# Altium schematic sheet USART_LPUART.SchDoc: USART_LPUART
size A3; Project: STM32L073Z-EVAL; Date: Not used; ApprovedBy: Not used; CheckedBy: Not used; Author: Not used; CompanyName: STMicroelectronics; DrawnBy: Not used; Engineer: Not used; Organization: Not used; Address1: Not used; Address2: Not used; Address3: Not used; Address4: Not used; DocumentNumber: 7; Revision: Not used; SheetNumber: 8; SheetTotal: 13; CurrentTime: Not used; CurrentDate: Not used; Time: Not used; DocumentFullPathAndName: Not used; DocumentName: Not used; ModifiedDate: Not used; ImagePath: Not used; ProjectName: Not used; Application_BuildNumber: Not used
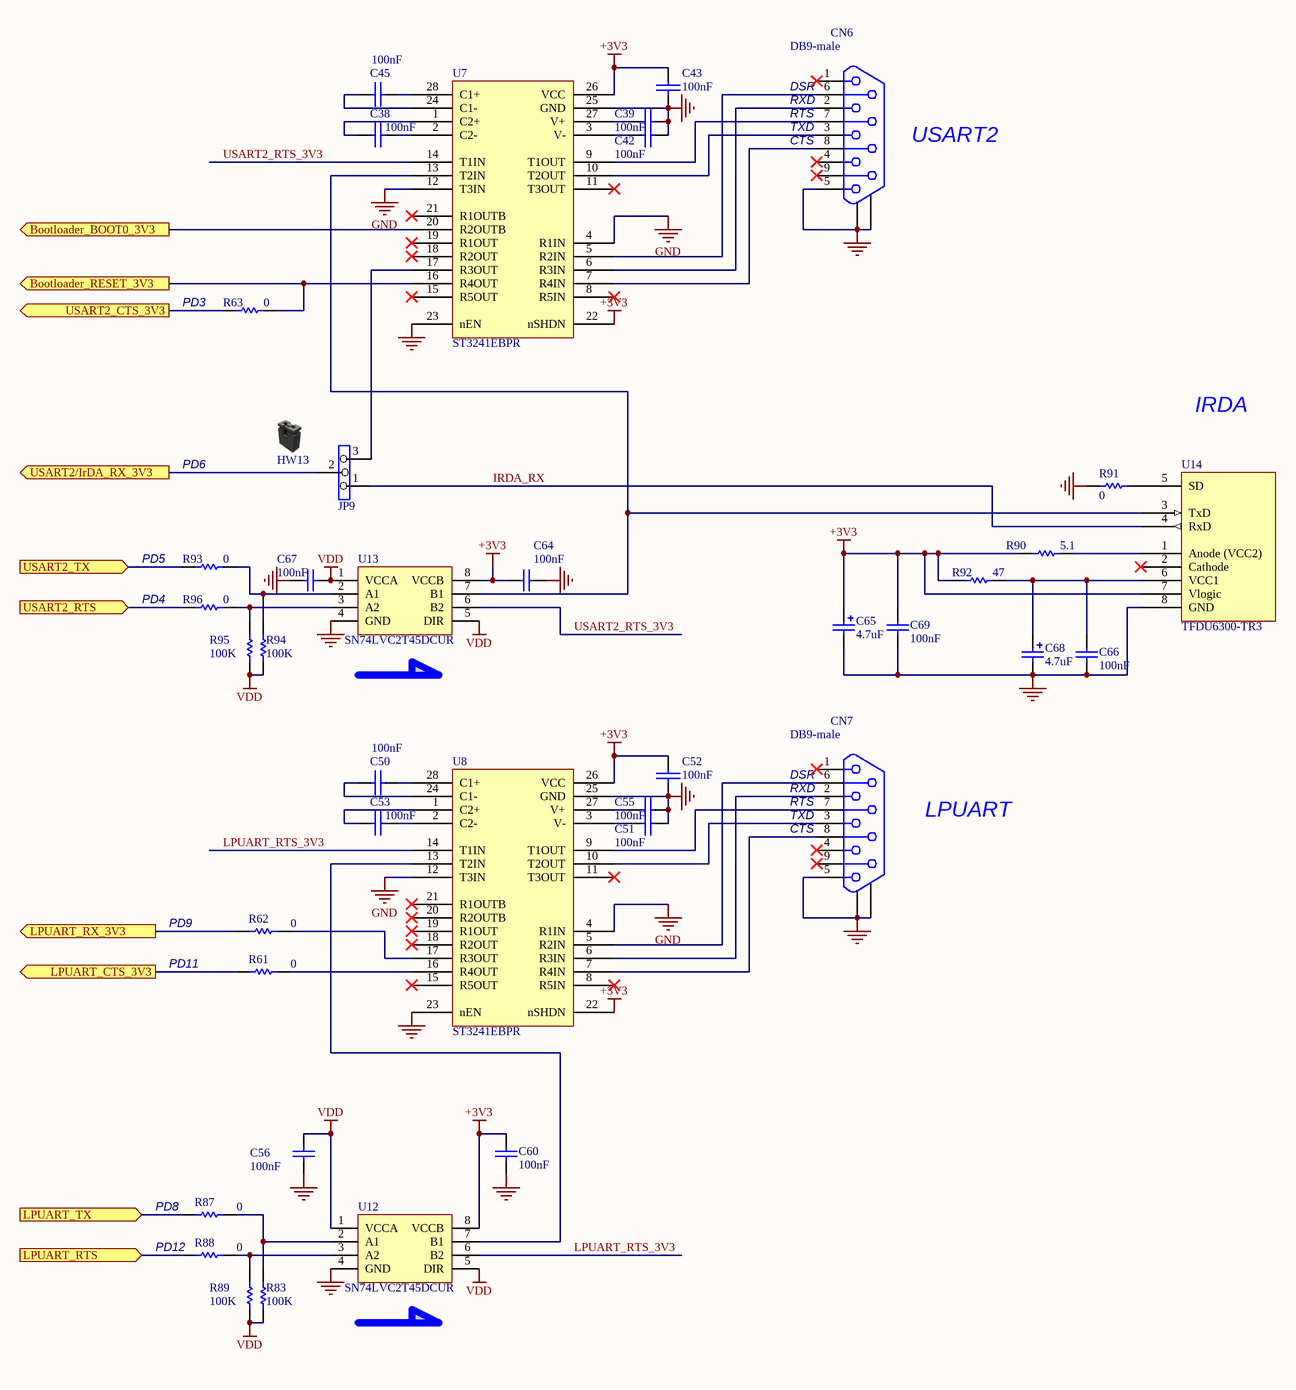
[diagram p0: USART_LPUART.SchDoc]

## Parts
C38  100nF  [0402C]
C39  100nF  [0402C]
C42  100nF  [0402C]
C43  100nF  [0402C]
C45  100nF  [0402C]
C50  100nF  [0402C]
C51  100nF  [0402C]
C52  100nF  [0402C]
C53  100nF  [0402C]
C55  100nF  [0402C]
C56  100nF  [0402C]
C60  100nF  [0402C]
C64  100nF  [0402C]
C65  4.7uF  [TAN-A]
C66  100nF  [0402C]
C67  100nF  [0402C]
C68  4.7uF  [TAN-A]
C69  100nF  [0402C]
CN6  DB9-male  [DB9/M]
CN7  DB9-male  [DB9/M]
HW13  Shunt Black 2.54mm  (value not drawn)  (mechanical)
JP9  (no value)  [SIP3]
R61  0  [0603R]
R62  0  [0603R]
R63  0  [0603R]
R83  100K  [0402R]
R87  0  [0603R]
R88  0  [0603R]
R89  100K  [0402R]
R90  5.1  [0402R]
R91  0  [0603R]
R92  47  [0402R]
R93  0  [0603R]
R94  100K  [0402R]
R95  100K  [0402R]
R96  0  [0603R]
U7  ST3241EBPR  [SSOP28_0R65_10R2X7R8]
U8  ST3241EBPR  [SSOP28_0R65_10R2X7R8]
U12  SN74LVC2T45DCUR  [USOP8_0R5_2X3R1]
U13  SN74LVC2T45DCUR  [USOP8_0R5_2X3R1]
U14  TFDU6300-TR3  [IR_VISHAY3]

## Ports
Bootloader_BOOT0_3V3 (out), Bootloader_RESET_3V3 (out), LPUART_CTS_3V3 (out), LPUART_RTS (in), LPUART_RX_3V3 (out), LPUART_TX (in), USART2/IrDA_RX_3V3 (out), USART2_CTS_3V3 (out), USART2_RTS (in), USART2_TX (in)

## Nets
+3V3: C43.2 C52.2 C60.2 C64.2 C65.1 C69.2 R90.1 R92.1 U7.22(nSHDN) U7.26(VCC) U8.22(nSHDN) U8.26(VCC) U12.8(VCCB) U13.8(VCCB) U14.7(Vlogic)
GND: C39.2 C42.2 C43.1 C51.2 C52.1 C55.2 C56.1 C60.1 C64.1 C65.2 C66.1 C67.1 C68.2 C69.1 CN6.5 CN6.10 CN6.11 CN7.5 CN7.10 CN7.11 R91.2 U7.4(R1IN) U7.12(T3IN) U7.23(nEN) U7.25(GND) U8.4(R1IN) U8.12(T3IN) U8.23(nEN) U8.25(GND) U12.4(GND) U13.4(GND) U14.8(GND)
VDD: C56.2 C67.2 R83.2 R89.2 R94.2 R95.2 U12.1(VCCA) U12.5(DIR) U13.1(VCCA) U13.5(DIR)
Bootloader_BOOT0_3V3: U7.20(R2OUTB) ; port Bootloader_BOOT0_3V3
Bootloader_RESET_3V3: R63.1 U7.16(R4OUT) ; port Bootloader_RESET_3V3
IRDA_RX: JP9.1 U14.4(RxD)
LPUART_CTS_3V3: R61.1 ; port LPUART_CTS_3V3
LPUART_RTS: R88.1 ; port LPUART_RTS
LPUART_RTS_3V3: U8.14(T1IN) U12.6(B2)
LPUART_RX_3V3: R62.1 ; port LPUART_RX_3V3
LPUART_TX: R87.1 ; port LPUART_TX
USART2/IrDA_RX_3V3: JP9.2 ; port USART2/IrDA_RX_3V3
USART2_CTS_3V3: R63.2 ; port USART2_CTS_3V3
USART2_RTS: R96.2 ; port USART2_RTS
USART2_RTS_3V3: U7.14(T1IN) U13.6(B2)
USART2_TX: R93.2 ; port USART2_TX
NetC38_1: C38.1 U7.1(C2+)
NetC38_2: C38.2 U7.2(C2-)
NetC39_1: C39.1 U7.27(V+)
NetC42_1: C42.1 U7.3(V-)
NetC45_1: C45.1 U7.24(C1-)
NetC45_2: C45.2 U7.28(C1+)
NetC50_1: C50.1 U8.24(C1-)
NetC50_2: C50.2 U8.28(C1+)
NetC51_1: C51.1 U8.3(V-)
NetC53_1: C53.1 U8.1(C2+)
NetC53_2: C53.2 U8.2(C2-)
NetC55_1: C55.1 U8.27(V+)
NetC66_2: C66.2 C68.1 R92.2 U14.6(VCC1)
NetCN6_2: CN6.2 U7.6(R3IN)
NetCN6_3: CN6.3 U7.10(T2OUT)
NetCN6_6: CN6.6 U7.5(R2IN)
NetCN6_7: CN6.7 U7.9(T1OUT)
NetCN6_8: CN6.8 U7.7(R4IN)
NetCN7_2: CN7.2 U8.6(R3IN)
NetCN7_3: CN7.3 U8.10(T2OUT)
NetCN7_6: CN7.6 U8.5(R2IN)
NetCN7_7: CN7.7 U8.9(T1OUT)
NetCN7_8: CN7.8 U8.7(R4IN)
NetJP9_3: JP9.3 U7.17(R3OUT)
NetR61_2: R61.2 U8.16(R4OUT)
NetR62_2: R62.2 U8.17(R3OUT)
NetR83_1: R83.1 R87.2 U12.2(A1)
NetR88_2: R88.2 R89.1 U12.3(A2)
NetR90_2: R90.2 U14.1(Anode_(VCC2))
NetR91_1: R91.1 U14.5(SD)
NetR93_1: R93.1 R94.1 U13.2(A1)
NetR95_1: R95.1 R96.1 U13.3(A2)
NetU7_13: U7.13(T2IN) U13.7(B1) U14.3(TxD)
NetU8_13: U8.13(T2IN) U12.7(B1)

Not connected (* = marked no-connect by the designer): CN6 1* 4* 9*; CN7 1* 4* 9*; U7 8(R5IN)* 11(T3OUT)* 15(R5OUT)* 18(R2OUT)* 19(R1OUT)* 21(R1OUTB)*; U8 8(R5IN)* 11(T3OUT)* 15(R5OUT)* 18(R2OUT)* 19(R1OUT)* 20(R2OUTB)* 21(R1OUTB)*; U14 2(Cathode)*

## Notes on the sheet
- (near CN6) RXD
- (near CN6) DSR
- (near CN6) RTS
- (near CN6) TXD
- (near CN6) CTS
- (near CN6) USART2
- (near R63) PD3
- IRDA
- PD6
- PD5
- PD4
- (near CN7) DSR
- (near CN7) RXD
- (near CN7) RTS
- (near CN7) TXD
- (near CN7) CTS
- LPUART
- PD11
- PD9
- (near R88) PD12
- (near R87) PD8
- Title:
- Project:
- Size:
- Revision:
- Variant:
- A3
- -
- Date:
- Reference:
- Sheet:
- of

## Library data of the parts
C38 C39 C42 C43 C45 C50-C53 C55 = CAP: Capacitor; Ordered by: Subcon; ECCN_US/EU: n/a
C56 C60 C64 C66 C67 C69 = CAP: Capacitor; Value: 100pF; Ordered by: Subcon; Published: 8-Jun-2000; Revision: July-2002: Re-released for DXP Platform.; Publisher: Altium Limited; ECCN_US/EU: n/a
C65 C68 = Cap Pol1: Polarized Capacitor (Radial); Ordered by: Subcon; Published: 8-Jun-2000; Revision: July-2002: Re-released for DXP Platform.; Publisher: Altium Limited; ECCN_US/EU: n/a
  C65: Value: 4.7 uF
  C68: Value: 4.7uF
CN6 = DB9: Manuf_1: lwconn; Manuf_Part_1: 50209M30111; Ordered by: Subcon; Comments: DB9 USART; Silkscreen: USART2; ECCN_US/EU: n/a
CN7 = DB9: Manuf_1: lwconn; Manuf_Part_1: 50209M30111; Ordered by: Subcon; Comments: DB9 USART; Silkscreen: LPUART; ECCN_US/EU: n/a
JP9 = Jumper3: Ordered by: Subcon; Silkscreen: 1,2: IRDA / 2,3: USART; Assembly: 2-3 (USART); ECCN_US/EU: n/a
R61-R63 R83 R87-R96 = Res1: Resistor; Value: 1K; Ordered by: Subcon; Published: 8-Jun-2000; Revision: July-2002: Re-released for DXP Platform.; Publisher: Altium Limited; ECCN_US/EU: n/a
U7 U8 = ST3241: Ordered by: ST; ECCN_US/EU: EAR99/NEC; Ref St: 9176312; Manuf_1: ST; Manuf_Part_1: ST3241EBPR
U12 U13 = SN74LVC2T45DCUT: Ordered by: Subcon; ECCN_US/EU: EAR99/NEC
U14 = TFDU4300: Ordered by: Subcon; ECCN_US/EU: EAR99/NEC